# Altium schematic sheet output.SchDoc
size A3; Organization: Altium Limited; Address1: L3, 12a Rodborough Rd; Address2: Frenchs Forest; Address3: NSW; Address4: Australia 2086
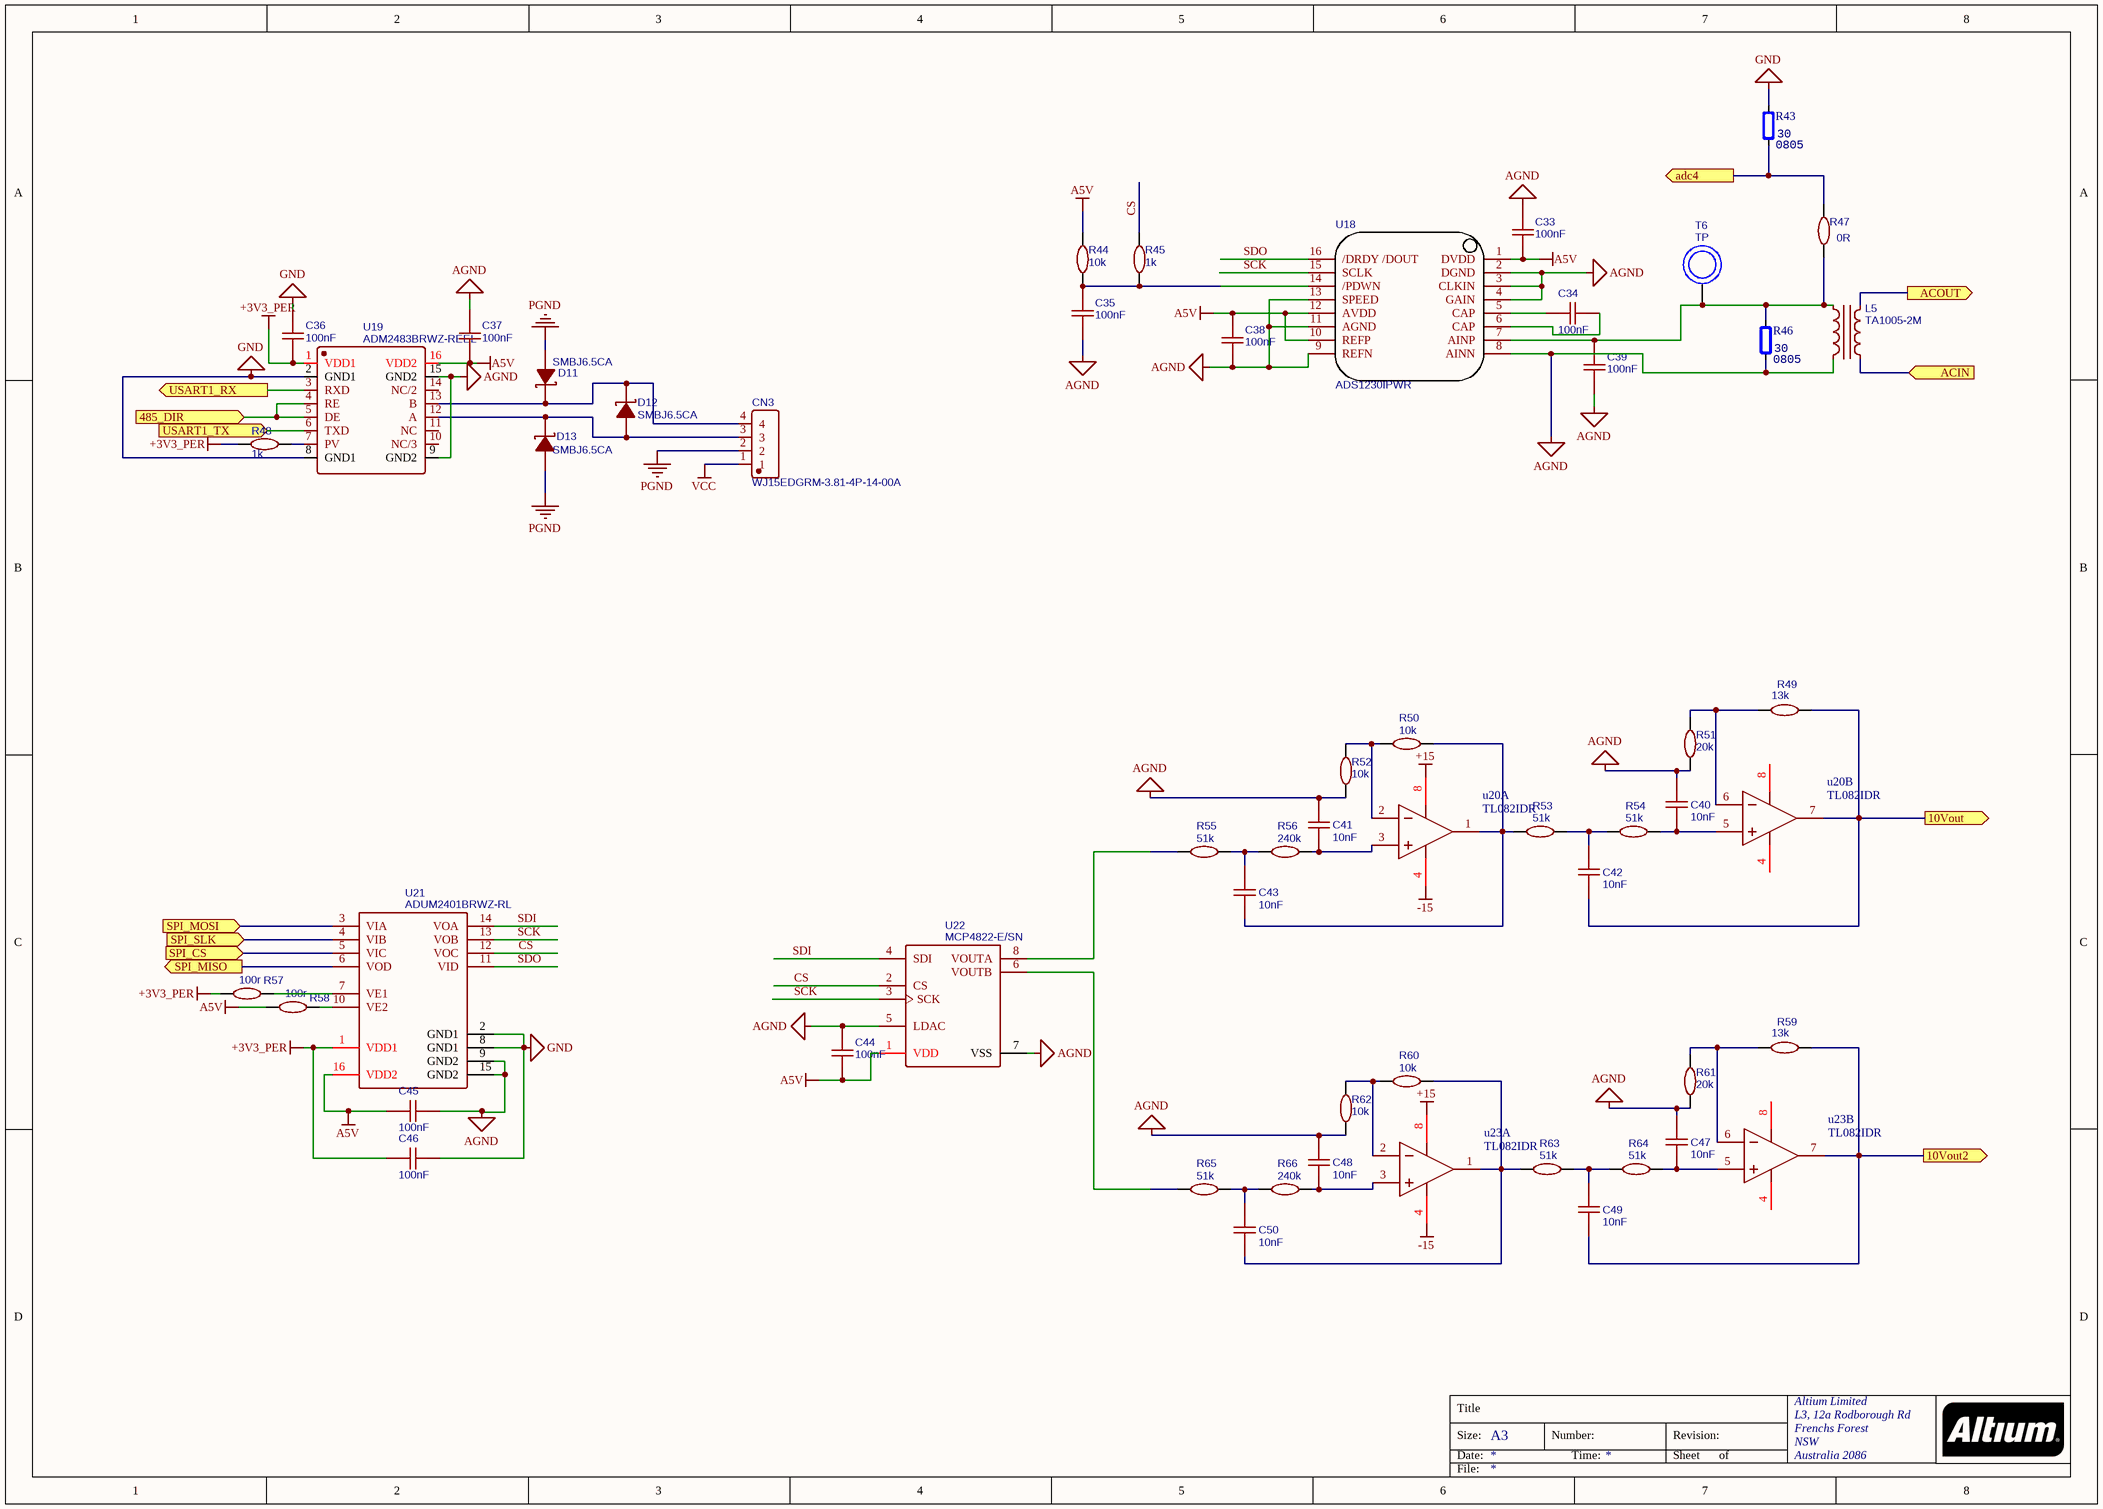
[diagram p0: output.SchDoc]

## Parts
C33  100nF  [0603 - cap]
C34  100nF  [0603 - cap]
C35  100nF  [0603 - cap]
C36  100nF  [0603 - cap]
C37  100nF  [0603 - cap]
C38  100nF  [0603 - cap]
C39  100nF  [0603 - cap]
C40  10nF  [0603 - cap]
C41  10nF  [0603 - cap]
C42  10nF  [0603 - cap]
C43  10nF  [0603 - cap]
C44  100nF  [0603 - cap]
C45  100nF  [0603 - cap]
C46  100nF  [0603 - cap]
C47  10nF  [0603 - cap]
C48  10nF  [0603 - cap]
C49  10nF  [0603 - cap]
C50  10nF  [0603 - cap]
CN3  WJ15EDGRM-3.81-4P-14-00A  [3.84-4p]
D11  SMBJ6.5CA  [SMB(DO-214AA)]
D12  SMBJ6.5CA  [SMB(DO-214AA)]
D13  SMBJ6.5CA  [SMB(DO-214AA)]
L5  TA1005-2M  [TA1005-2M]
R43  value 30  Type: 0805  [RES_0805]  (hidden comment: R0805)
R44  10k  [0603-res]
R45  1k  [0603-res]
R46  value 30  Type: 0805  [RES_0805]  (hidden comment: R0805)
R47  0R  [0603-res]
R48  1k  [0603-res]
R49  13k  [0603-res]
R50  10k  [0603-res]
R51  20k  [0603-res]
R52  10k  [0603-res]
R53  51k  [0603-res]
R54  51k  [0603-res]
R55  51k  [0603-res]
R56  240k  [0603-res]
R57  100r  [0603-res]
R58  100r  [0603-res]
R59  13k  [0603-res]
R60  10k  [0603-res]
R61  20k  [0603-res]
R62  10k  [0603-res]
R63  51k  [0603-res]
R64  51k  [0603-res]
R65  51k  [0603-res]
R66  240k  [0603-res]
T6  TP  [tp]
U18  ADS1230IPWR  [TSSOP-16]
U19  ADM2483BRWZ-REEL  [SOIC-16_300MIL]
u20  TL082IDR  [SOIC-8_150MIL]  (parts A,B of 2)
U21  ADUM2401BRWZ-RL  [SOIC-16_300MIL]
U22  MCP4822-E/SN  [SOIC-8_150MIL]
u23  TL082IDR  [SOIC-8_150MIL]  (parts A,B of 2)

## Ports
10Vout2 (out), 10Vout (out), 485_DIR (in), ACIN (in), ACOUT (out), adc4 (out), SPI_CS (in), SPI_MISO (out), SPI_MOSI (in), SPI_SLK (in), USART1_RX (out), USART1_TX (in)

## Nets
+3V3_PER: C36.2 C46.2 R48.1 R57.1 U19.1(VDD1) U21.1(VDD1)
+15: u20.8(VCC+) u23.8(VCC+)
-15: u20.4(VCC-) u23.4(VCC-)
A5V: C33.2 C37.2 C38.1 C44.2 C45.2 R44.2 R58.1 U18.1(DVDD) U18.10(REFP) U18.12(AVDD) U19.16(VDD2) U21.16(VDD2) U22.1(VDD)
AGND: C33.1 C35.2 C37.1 C38.2 C39.2 C40.2 C41.2 C44.1 C45.1 C47.2 C48.2 L5.4 R46.1 R51.1 R52.1 R61.1 R62.1 U18.2(DGND) U18.3(CLKIN) U18.4(GAIN) U18.8(AINN) U18.9(REFN) U18.11(AGND) U18.13(SPEED) U19.9(GND2) U19.15(GND2) U21.9(GND2) U21.15(GND2) U22.5(LDAC) U22.7(VSS)
GND: C36.1 C46.1 R43.2 U19.2(GND1) U19.8(GND1) U21.2(GND1) U21.8(GND1)
PGND: CN3.2 D11.1 D13.1
VCC: CN3.1
10Vout: C42.1 R49.2 u20.7(OUT2) ; port 10Vout
10Vout2: C49.1 R59.2 u23.7(OUT2) ; port 10Vout2
485_DIR: U19.4(RE) U19.5(DE) ; port 485_DIR
ACIN: L5.1 ; port ACIN
ACOUT: L5.2 ; port ACOUT
adc4: R43.1 R47.2 ; port adc4
CS: R45.2 U21.12(VOC) U22.2(CS)
SCK: U18.15(SCLK) U21.13(VOB) U22.3(SCK)
SDI: U21.14(VOA) U22.4(SDI)
SDO: U18.16(/DRDY_/DOUT) U21.11(VID)
SPI_CS: U21.5(VIC) ; port SPI_CS
SPI_MISO: U21.6(VOD) ; port SPI_MISO
SPI_MOSI: U21.3(VIA) ; port SPI_MOSI
SPI_SLK: U21.4(VIB) ; port SPI_SLK
USART1_RX: U19.3(RXD) ; port USART1_RX
USART1_TX: U19.6(TXD) ; port USART1_TX
NetC34_1: C34.1 U18.5(CAP)
NetC34_2: C34.2 U18.6(CAP)
NetC35_1: C35.1 R44.1 R45.1 U18.14(/PDWN)
NetC39_1: C39.1 L5.3 R46.2 R47.1 T6.1 U18.7(AINP)
NetC40_1: C40.1 R54.2 u20.5(IN2+)
NetC41_1: C41.1 R56.2 u20.3(IN1+)
NetC42_2: C42.2 R53.2 R54.1
NetC43_1: C43.1 R50.2 R53.1 u20.1(OUT1)
NetC43_2: C43.2 R55.2 R56.1
NetC47_1: C47.1 R64.2 u23.5(IN2+)
NetC48_1: C48.1 R66.2 u23.3(IN1+)
NetC49_2: C49.2 R63.2 R64.1
NetC50_1: C50.1 R60.2 R63.1 u23.1(OUT1)
NetC50_2: C50.2 R65.2 R66.1
NetCN3_3: CN3.3 D12.1 D13.2 U19.12(A)
NetCN3_4: CN3.4 D11.2 D12.2 U19.13(B)
NetR48_2: R48.2 U19.7(PV)
NetR49_1: R49.1 R51.2 u20.6(IN2-)
NetR50_1: R50.1 R52.2 u20.2(IN1-)
NetR55_1: R55.1 U22.8(VOUTA)
NetR57_2: R57.2 U21.7(VE1)
NetR58_2: R58.2 U21.10(VE2)
NetR59_1: R59.1 R61.2 u23.6(IN2-)
NetR60_1: R60.1 R62.2 u23.2(IN1-)
NetR65_1: R65.1 U22.6(VOUTB)

Not connected (* = marked no-connect by the designer): U19 10(NC/3) 11(NC) 14(NC/2)

## Notes on the sheet
- Title
- Size:
- Date:
- A3
- Number:
- Time:
- Revision:
- Sheet
- of
- File:

## Library data of the parts
C33-C50 = (no symbol name): BOM_Manufacturer: YAGEO; BOM_Manufacturer Part: CC0603KRX7R9BB104; nameAlias: Capacitance; BOM_Supplier: LCSC; BOM_LCSC: C14663; BOM_LCSC Assembly: Yes; spicePre: C; spiceSymbolName: CC0603KRX7R9BB104
CN3 = (no symbol name): BOM_Manufacturer: ReliaPro; Contributor: LCSC; BOM_Supplier: LCSC; BOM_LCSC: C160127; BOM_Manufacturer Part: WJ15EDGRM-3.81-4P-14-00A; spicePre: C
D11-D13 = (no symbol name): BOM_Manufacturer: MDD; BOM_Supplier: LCSC; BOM_Manufacturer Part: SMBJ6.5CA; BOM_LCSC: C113979; spicePre: D
L5 = (no symbol name): BOM_Manufacturer: TSFAR; nameAlias: Value; BOM_Supplier: LCSC; BOM_Manufacturer Part: TA1005-2M; BOM_LCSC: C128247; spicePre: L; spiceSymbolName: TA1005-2M
R43 R46 = Res_0805: Resistor; Specification: ±5%; Manufacturer: *
R44 R45 R47-R66 = (no symbol name): BOM_Manufacturer: UniOhm; BOM_Manufacturer Part: 0603WAF1001T5E; nameAlias: Value; BOM_Supplier: LCSC; BOM_LCSC: C21190; BOM_LCSC Assembly: Yes; spicePre: R; spiceSymbolName: 0603WAF1001T5E
U18 = (no symbol name): BOM_Manufacturer: TI; BOM_Supplier: LCSC; BOM_Manufacturer Part: ADS1230IPWR; BOM_LCSC: C58052; image: //image.lceda.cn/szlcsc/C58052.jpg; spicePre: U
U19 U21 = (no symbol name): BOM_Manufacturer: ADI; BOM_Supplier: LCSC; spicePre: U
  U19: BOM_Manufacturer Part: ADM2483BRWZ-REEL; BOM_LCSC: C9637; BOM_LCSC Assembly: Yes; image: //image.lceda.cn/szlcsc/C9637.jpg
  U21: BOM_Manufacturer Part: ADUM2401BRWZ-RL; BOM_LCSC: C18965; image: //image.lceda.cn/szlcsc/C18965.jpg
u20 u23 = tl802t
U22 = (no symbol name): BOM_Manufacturer: MICROCHIP; BOM_Supplier: LCSC; BOM_Manufacturer Part: MCP4822-E/SN; BOM_LCSC: C16040; spicePre: U
T6 = (no symbol name): BOM_Manufacturer Part: ?; spicePre: T